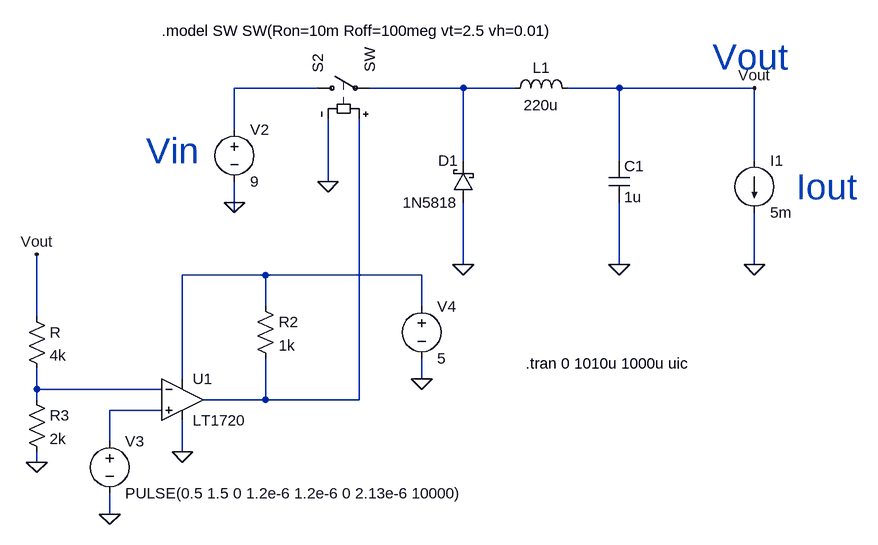
[diagram p0: schematic DC-DC Step down.asc]
DC-DC Step down.asc, the LTspice schematic file:
Version 4
SHEET 1 1416 1092
WIRE 320 48 192 48
WIRE 544 48 400 48
WIRE 624 48 544 48
WIRE 784 48 704 48
WIRE 992 48 784 48
WIRE 192 112 192 48
WIRE 544 160 544 48
WIRE 784 160 784 48
WIRE 992 160 992 48
WIRE 336 192 336 96
WIRE 192 224 192 192
WIRE 192 240 192 224
WIRE 544 320 544 224
WIRE 784 320 784 224
WIRE 992 320 992 240
WIRE 240 336 112 336
WIRE 480 336 240 336
WIRE 240 384 240 336
WIRE 480 384 480 336
WIRE -112 400 -112 304
WIRE 112 496 112 336
WIRE 480 496 480 464
WIRE -112 512 -112 480
WIRE 80 512 -112 512
WIRE -112 528 -112 512
WIRE 240 528 240 464
WIRE 240 528 144 528
WIRE 384 528 384 96
WIRE 384 528 240 528
WIRE 80 544 0 544
WIRE 0 592 0 544
WIRE 112 608 112 560
WIRE -112 624 -112 608
WIRE 0 704 0 672
FLAG 544 320 0
FLAG 784 320 0
FLAG 992 320 0
FLAG 192 224 0
FLAG 0 704 0
FLAG 112 608 0
FLAG 480 496 0
FLAG 336 192 0
FLAG -112 624 0
FLAG 992 48 Vout
FLAG -112 304 Vout
SYMBOL schottky 560 224 R180
WINDOW 0 24 64 Left 2
WINDOW 3 24 0 Left 2
SYMATTR InstName D1
SYMATTR Value 1N5818
SYMATTR Description Diode
SYMATTR Type diode
SYMBOL ind 608 64 R270
WINDOW 0 32 56 VTop 2
WINDOW 3 5 56 VBottom 2
SYMATTR InstName L1
SYMATTR Value 220u
SYMATTR SpiceLine Rser=1400m
SYMBOL cap 768 160 R0
SYMATTR InstName C1
SYMATTR Value 1u
SYMBOL current 992 160 R0
WINDOW 123 0 0 Left 2
WINDOW 39 0 0 Left 2
SYMATTR InstName I1
SYMATTR Value 5m
SYMBOL voltage 192 96 R0
WINDOW 123 0 0 Left 2
WINDOW 39 0 0 Left 2
SYMATTR InstName V2
SYMATTR Value 9
SYMBOL Comparators\\LT1720 112 464 R0
SYMATTR InstName U1
SYMBOL voltage 0 576 R0
WINDOW 123 0 0 Left 2
WINDOW 39 0 0 Left 2
SYMATTR InstName V3
SYMATTR Value PULSE(0.5 1.5 0 1.2e-6 1.2e-6 0 2.13e-6 10000)
SYMBOL voltage 480 368 R0
WINDOW 123 0 0 Left 2
WINDOW 39 0 0 Left 2
SYMATTR InstName V4
SYMATTR Value 5
SYMBOL res 224 368 R0
SYMATTR InstName R2
SYMATTR Value 1k
SYMBOL sw 304 48 R270
SYMATTR InstName S2
SYMBOL res -128 384 R0
SYMATTR InstName R
SYMATTR Value 4k
SYMBOL res -128 512 R0
SYMATTR InstName R3
SYMATTR Value 2k
TEXT 640 472 Left 2 !.tran 0 1010u 1000u uic
TEXT 56 144 Left 5 ;Vin
TEXT 1056 200 Left 5 ;Iout
TEXT 928 0 Left 5 ;Vout
TEXT 80 -40 Left 2 !.model SW SW(Ron=10m Roff=100meg vt=2.5 vh=0.01)

The netlist it stands for:
* DC-DC Step down.asc
D1 0 N002 1N5818
L1 N002 Vout 220u Rser=1400m
C1 Vout 0 1u
I1 Vout 0 5m
V2 N001 0 9
XU1 N006 N004 N003 0 N005 LT1720  ; pins In+ In- V+ V- OUT
V3 N006 0 PULSE(0.5 1.5 0 1.2e-6 1.2e-6 0 2.13e-6 10000)
V4 N003 0 5
R2 N003 N005 1k
S2 N001 N002 N005 0 SW
R Vout N004 4k
R3 N004 0 2k
.model D D
.lib standard.dio
.tran 0 1010u 1000u uic
* Vin
* Iout
* Vout
.model SW SW(Ron=10m Roff=100meg vt=2.5 vh=0.01)
.lib LT1720.sub
.backanno
.end